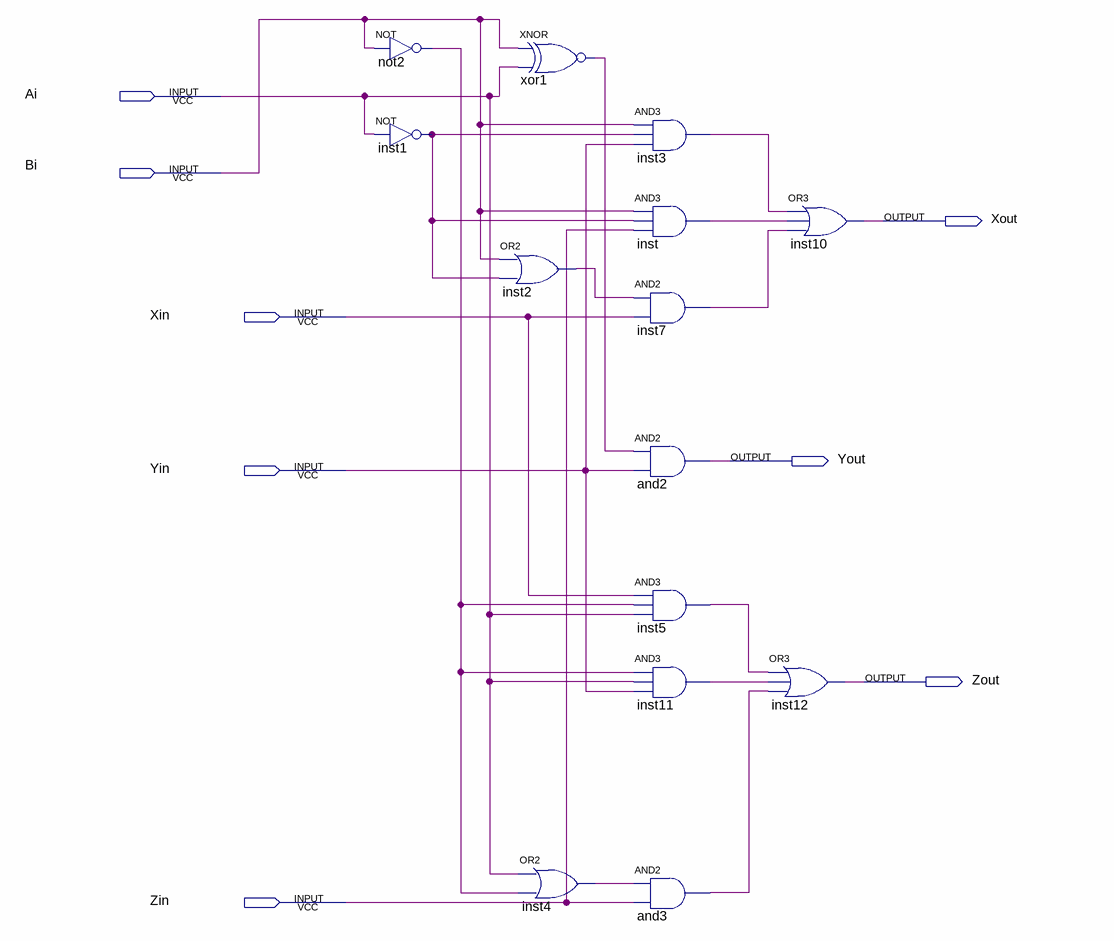
[diagram p0: schematic sheet]
// Quartus schematic SignedLastBitCmp.bdf as structural Verilog: 14 symbols, 8 pins
module SignedLastBitCmp (
  input  Ai,
  input  Bi,
  input  Xin,
  input  Yin,
  input  Zin,
  output Xout,
  output Yout,
  output Zout
);

  wire and3_out, inst1_out, inst2_out, inst3_out, inst4_out, inst5_out, inst7_out, inst11_out, inst_out,
       not2_out, xor1_out;

  not not2 (not2_out, Bi);
  not inst1 (inst1_out, Ai);
  or inst2 (inst2_out, Bi, inst1_out);
  xnor xor1 (xor1_out, Bi, Ai);
  or inst4 (inst4_out, Ai, not2_out);
  and inst3 (inst3_out, Bi, inst1_out, Yin);
  and inst (inst_out, Bi, inst1_out, Zin);
  and inst7 (inst7_out, inst2_out, Xin);
  and and2 (Yout, xor1_out, Yin);
  and inst5 (inst5_out, Xin, not2_out, Ai);
  and inst11 (inst11_out, not2_out, Ai, Yin);
  and and3 (and3_out, inst4_out, Zin);
  or inst10 (Xout, inst3_out, inst_out, inst7_out);
  or inst12 (Zout, inst5_out, inst11_out, and3_out);
endmodule
